# Altium project FEU31_Part2.PrjPcb
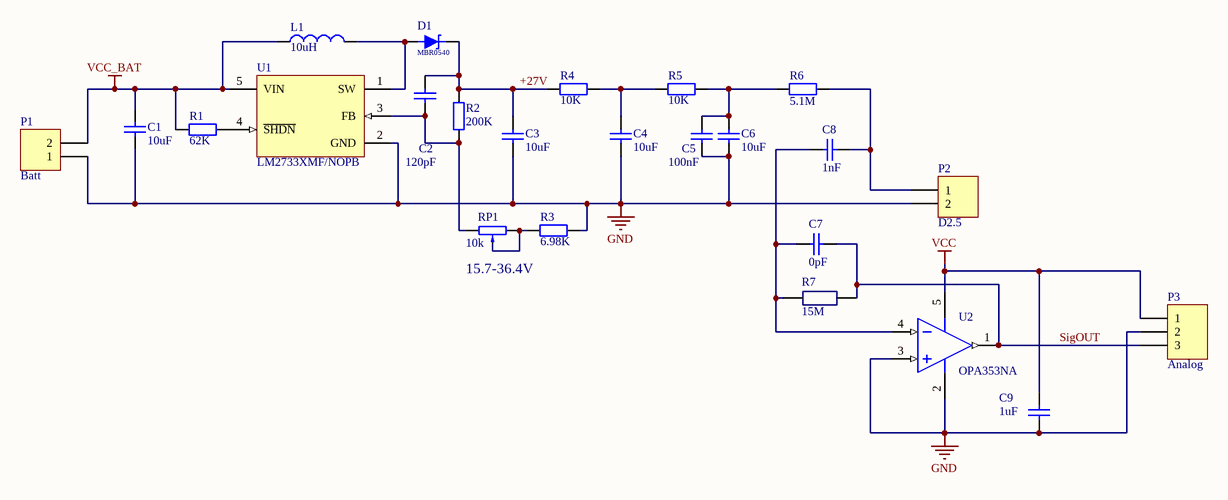
[diagram p0: FEU31_Part2.SchDoc]
1 sheet, 24 parts. Net scope: global (net labels, ports and power ports of the same name join across sheets).
Board file: FEU31_Part2.PcbDoc

## Sheet FEU31_Part2.SchDoc: Интерфейсный модуль ФЭУ-102
size A3; Address1: (с) Быканов Андрей; Address2: г.Тула 2016г.; Revision: 1.3

### Parts
C1  10uF  [C1206]
C2  120pF  [1608[0603]]
C3  10uF  [C1206]
C4  10uF  [C1206]
C5  100nF  [1608[0603]]
C6  10uF  [C1206]
C7  0pF  [1608[0603]]
C8  1nF  [1608[0603]]
C9  1uF  [1608[0603]_CAP]
D1  MBR0540  [SOD123]
L1  value 10uH  [IFSC1515AHER100M01]  (hidden comment: Inductor)
P1  Batt  [HDR1X2]
P2  D2.5  [HDR1X2]
P3  Analog  [HDR1X3]
R1  62K  [1608[0603]_RES]
R2  200K  [1608[0603]_RES]
R3  6.98K  [1608[0603]_RES]
R4  10K  [1608[0603]_RES]
R5  10K  [1608[0603]_RES]
R6  5.1M  [1608[0603]_RES]
R7  15M  [1608[0603]_RES]
RP1  10k  [3224W]
U1  LM2733XMF/NOPB  [MF05A_N]
U2  OPA353NA  [ADI-RJ-5_N]

### Nets
GND: C1.2 C3.2 C4.2 C5.1 C6.2 C9.2 P1.1 P2.2 P3.2 R3.2 U1.2(GND) U2.2(-V) U2.3(+IN_A)
VCC: C9.1 P3.1 U2.5(+V)
VCC_BAT: C1.1 L1.1 P1.2 R1.2 U1.5(VIN)
+27V: C2.2 C3.1 D1.2(K) R2.1 R4.2
SigOUT: C7.2 P3.3 R7.2 U2.1(OUT_A)
NetC2_1: C2.1 R2.2 RP1.3 U1.3(FB)
NetC4_1: C4.1 R4.1 R5.2
NetC5_2: C5.2 C6.1 R5.1 R6.2
NetC7_1: C7.1 C8.2 R7.1(A) U2.4(-IN_A)
NetC8_1: C8.1 P2.1 R6.1
NetD1_1: D1.1(A) L1.2 U1.1(SW)
NetR1_1: R1.1 U1.4(~{SHDN})
NetR3_1: R3.1 RP1.1 RP1.2

### Notes on the sheet
- 15.7-36.4V
- Title
- Size:
- Date:
- A3
- Number:
- Time:
- Revision:
- Sheet
- of
- File:

### Library data of the parts
C1 C3 C4 C6 = Cap Semi: Capacitor (Semiconductor SIM Model); Order: CC1206KKX7R8BB475; Published: 8-Jun-2000; LatestRevisionDate: 29-May-2009; LatestRevisionNote: IPC-7351 Footprint Added.; PackageReference: C1206; Publisher: Altium Limited; PackageDescription: Chip Capacitor; Value: 10uF
C2 C5 C7 C8 = Cap Semi: Capacitor (Semiconductor SIM Model); Order: CC0603CRNPO9BN2R2; Published: 8-Jun-2000; LatestRevisionDate: 29-May-2009; LatestRevisionNote: IPC-7351 Footprint Added.; PackageReference: C1206; Publisher: Altium Limited; PackageDescription: Chip Capacitor
  C2: Value: 120pF
  C5: Value: 100nF
  C7: Value: 0pF
  C8: Value: 1nF
C9 = Cap Semi: Capacitor (Semiconductor SIM Model); Order: CC0603KRX5R7BB105; Published: 8-Jun-2000; LatestRevisionDate: 29-May-2009; LatestRevisionNote: IPC-7351 Footprint Added.; PackageReference: C1206; Publisher: Altium Limited; PackageDescription: Chip Capacitor; Value: 1uF
D1 = MBR0540: SMD 40V 0.5A; Price: 0.19
L1 = Inductor: Code_IEC: 1005; Published: 8-Jun-2000; LatestRevisionDate: 29-May-2009; LatestRevisionNote: IPC-7351 Footprint Added.; PackageReference: 0402-A; Publisher: Altium Limited; PackageDescription: Chip Inductor; Code_JEITA: 0402
P1 P2 = Header 2: Header, 2-Pin; LatestRevisionDate: 17-Jul-2002; LatestRevisionNote: Re-released for DXP Platform.; Publisher: Altium Limited
P3 = Header 3: Header, 3-Pin; LatestRevisionDate: 17-Jul-2002; LatestRevisionNote: Re-released for DXP Platform.; Publisher: Altium Limited
R1-R6 = Res2: Resistor; Published: 8-Jun-2000; LatestRevisionDate: 17-Jul-2002; LatestRevisionNote: Re-released for DXP Platform.; PackageReference: AXIAL-0.4; Publisher: Altium Limited; PackageDescription: Axial Device, Thru-Hole; 2 Leads; 0.4 in Pin Spacing
  R1: Value: 62K
  R2: Value: 200K
  R3: Value: 6.98K
  R4 R5: Value: 10K
  R6: Value: 5.1M
R7 = Resistor 0805: Order: RC0603JR-0762KL; Value: 15M
RP1 = R-Tr 3296W (64W): Bourns 3296W 0.5W 25 Turns; Set Position: 0.5; Price: 1.20; Value: 10k
U1 = LM2733XMF/NOPB: 0.6/1.6 MHz Boost Converters With 40V Internal FET Switch in 5-pin SOT-23, Pb-Free; Manufacturer: National Semiconductor; PackageTopMarking: S52A*XTT; PowerWise: N; CompType: Switcher; Published: 1-Mar-2010; DatasheetVersion: Jul-2007; PackageVersion: revD, Aug-2008; PackageReference: MF05A; Publisher: Altium Limited; PackageDescription: Molded SOT-23, .115 x .063 x .040 in Body, 5 Lead, .0375 in Pitch; Supplier 1: Digi-Key; Supplier Part Number 1: LM2733XMFTR-ND; Supplier 2: Digi-Key; Supplier Part Number 2: LM2733XMFCT-ND; Supplier 3: Digi-Key; Supplier Part Number 3: LM2733XMFDKR-ND; Supplier 4: Farnell; Supplier Part Number 4: 1496114; PartNumber: LM2733XMF/NOPB; RoHS: Y; PinCount: 5; ComponentLink1Description: LM2733 Datasheet; ComponentLink1URL: http://www.national.com/ds/LM/LM2733.pdf; ComponentLink2Description: LM2733 Web Page; ComponentLink2URL: http://www.national.com/pf/LM/LM2733.html; ComponentLink3Description: MF05A Package Page; ComponentLink3URL: http://www.national.com/packaging/folders/mf05a.html
U2 = AD8541ARTZ-R2: Single Channel RRIO Operational Amplifier, 1 MHz BW, 920 mV/us SR, Industrial, 5-pin SOT23 (RJ-5), Reel; Generic Part Number: AD8541; Manufacturer: Analog Devices; Amplifiers Per Package: 1; Input Bias Current: 4pA; Input Offset Voltage: 1mV; Iq/Amp: 65uA; Small Signal Bandwidth: 1MHz; V Span Max: 5.5V; V Span Min: 2.7V; DatasheetVersion: Rev. G; PackageVersion: 121608-A; PackageReference: RJ-5; PackageDescription: 5-Pin Small Outline Transistor Package, Body 2.9 x 1.6 mm, Pitch 0.95 mm; Supplier 1: Digi-Key; Supplier Part Number 1: AD8541ARTZ-R2TR-ND; Supplier 2: Digi-Key; Supplier Part Number 2: AD8541ARTZ-R2CT-ND; Supplier 3: Digi-Key; Supplier Part Number 3: AD8541ARTZ-R2DKR-ND; Supplier 4: Farnell; Supplier Part Number 4: 1837434; Supplier 5: Newark; Supplier Part Number 5: 59K6820; Slew Rate: 920mV/us; Mounting Technology: Surface Mount; Code_JEDEC: MO-178-AA; PartNumber: AD8541ARTZ-R2; ComponentLink1Description: Manufacturer URL; ComponentLink1URL: http://www.analog.com/en/index.html; ComponentLink2Description: Datasheet; ComponentLink2URL: http://www.analog.com/static/imported-files/data_sheets/AD8541_8542_8544.pdf; ComponentLink3Description: Package Specification; ComponentLink3URL: http://www.analog.com/static/imported-files/packages/PKG_PDF/SOT-23(RJ)/RJ_5.pdf; ComponentLink4Description: Reference Circuit; ComponentLink4URL: http://www.analog.com/en/all-operational-amplifiers-op-amps/operational-amplifiers-op-amps/ad8541/products/product.html#product-recommendations; Order: OPA353NA